# EAGLE design wa_amp (EAGLE 9.5.1)
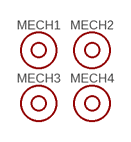
[diagram p0: schematic, sheet 1, part 1 of 2]
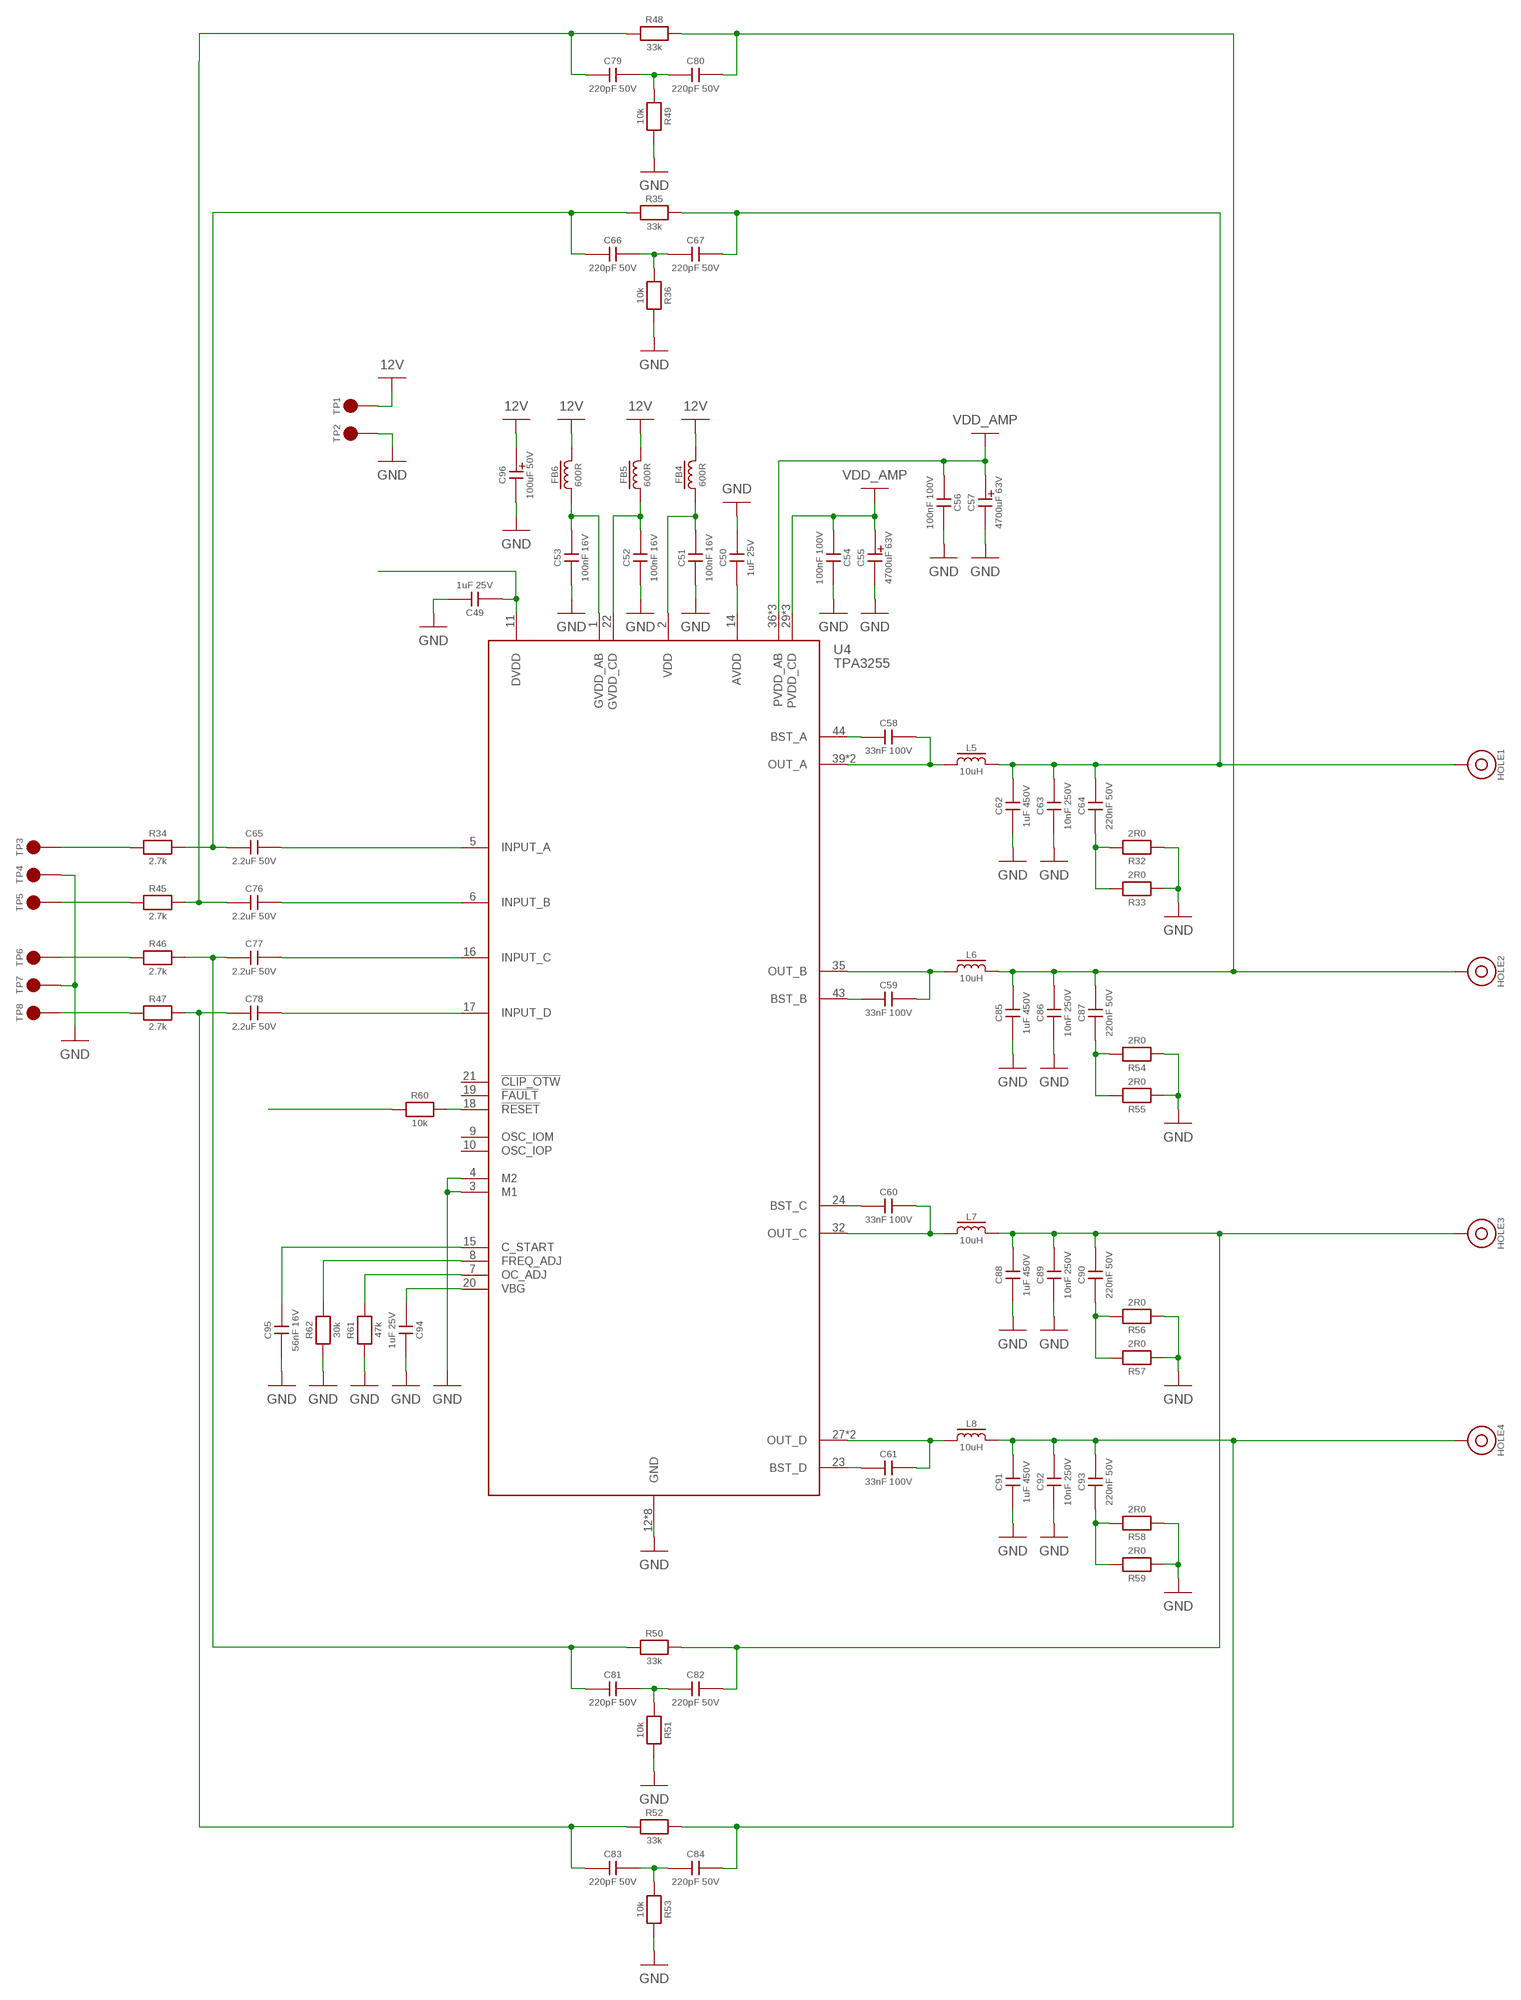
[diagram p1: schematic, sheet 1, part 2 of 2]

## Parts
C49  1uF 25V  CL10A105KA8NNNC  [0603]
C50  1uF 25V  CL10A105KA8NNNC  [0603]
C51  100nF 16V  CL10B104KO8WPNC  [0603]
C52  100nF 16V  CL10B104KO8WPNC  [0603]
C53  100nF 16V  CL10B104KO8WPNC  [0603]
C54  100nF 100V  06031C104KAT2A  [0603]
C55  4700uF 63V  B41231C8478M000  [30MM_RADIAL_10MM_PITCH]
C56  100nF 100V  06031C104KAT2A  [0603]
C57  4700uF 63V  B41231C8478M000  [30MM_RADIAL_10MM_PITCH]
C58  33nF 100V  C0603C333K1RACTU  [0603]
C59  33nF 100V  C0603C333K1RACTU  [0603]
C60  33nF 100V  C0603C333K1RACTU  [0603]
C61  33nF 100V  C0603C333K1RACTU  [0603]
C62  1uF 450V  ECWFE2W105K  [7X17.5BOX]
C63  10nF 250V  885342206006  [0603]
C64  220nF 50V  C1608X7R1H224K080AB  [0603]
C65  2.2uF 50V  MKS2B042201F00KSSD  [5X7.2BOX]
C66  220pF 50V  CC0603JRNPO9BN221  [0603]
C67  220pF 50V  CC0603JRNPO9BN221  [0603]
C76  2.2uF 50V  MKS2B042201F00KSSD  [5X7.2BOX]
C77  2.2uF 50V  MKS2B042201F00KSSD  [5X7.2BOX]
C78  2.2uF 50V  MKS2B042201F00KSSD  [5X7.2BOX]
C79  220pF 50V  CC0603JRNPO9BN221  [0603]
C80  220pF 50V  CC0603JRNPO9BN221  [0603]
C81  220pF 50V  CC0603JRNPO9BN221  [0603]
C82  220pF 50V  CC0603JRNPO9BN221  [0603]
C83  220pF 50V  CC0603JRNPO9BN221  [0603]
C84  220pF 50V  CC0603JRNPO9BN221  [0603]
C85  1uF 450V  ECWFE2W105K  [7X17.5BOX]
C86  10nF 250V  885342206006  [0603]
C87  220nF 50V  C1608X7R1H224K080AB  [0603]
C88  1uF 450V  ECWFE2W105K  [7X17.5BOX]
C89  10nF 250V  885342206006  [0603]
C90  220nF 50V  C1608X7R1H224K080AB  [0603]
C91  1uF 450V  ECWFE2W105K  [7X17.5BOX]
C92  10nF 250V  885342206006  [0603]
C93  220nF 50V  C1608X7R1H224K080AB  [0603]
C94  1uF 25V  CL10A105KA8NNNC  [0603]
C95  56nF 16V  GRM188R71C563JA01D  [0603]
C96  100uF 50V  107CKR050M  [8MM_RADIAL_3.5MM_PITCH]
FB4  600R  742792651  [0603]
FB5  600R  742792651  [0603]
FB6  600R  742792651  [0603]
HOLE1  MOUNTHOLE_METAL6X3  [MOUNTHOLE_6X3_METAL]
HOLE2  MOUNTHOLE_METAL6X3  [MOUNTHOLE_6X3_METAL]
HOLE3  MOUNTHOLE_METAL6X3  [MOUNTHOLE_6X3_METAL]
HOLE4  MOUNTHOLE_METAL6X3  [MOUNTHOLE_6X3_METAL]
L5  10uH  SRP1265A-100M  [SRP1265A]
L6  10uH  SRP1265A-100M  [SRP1265A]
L7  10uH  SRP1265A-100M  [SRP1265A]
L8  10uH  SRP1265A-100M  [SRP1265A]
MECH1  6mm x 3mm  MOUNTHOLE  [MOUNTHOLE_6X3]
MECH2  6mm x 3mm  MOUNTHOLE  [MOUNTHOLE_6X3]
MECH3  6mm x 3mm  MOUNTHOLE  [MOUNTHOLE_6X3]
MECH4  6mm x 3mm  MOUNTHOLE  [MOUNTHOLE_6X3]
R32  2R0  CRCW12062R00FNEA  [1206]
R33  2R0  CRCW12062R00FNEA  [1206]
R34  2.7k  ERJ3EKF2701V  [0603]
R35  33k  ERJ3EKF3302V  [0603]
R36  10k  ERJ3EKF1002V  [0603]
R45  2.7k  ERJ3EKF2701V  [0603]
R46  2.7k  ERJ3EKF2701V  [0603]
R47  2.7k  ERJ3EKF2701V  [0603]
R48  33k  ERJ3EKF3302V  [0603]
R49  10k  ERJ3EKF1002V  [0603]
R50  33k  ERJ3EKF3302V  [0603]
R51  10k  ERJ3EKF1002V  [0603]
R52  33k  ERJ3EKF3302V  [0603]
R53  10k  ERJ3EKF1002V  [0603]
R54  2R0  CRCW12062R00FNEA  [1206]
R55  2R0  CRCW12062R00FNEA  [1206]
R56  2R0  CRCW12062R00FNEA  [1206]
R57  2R0  CRCW12062R00FNEA  [1206]
R58  2R0  CRCW12062R00FNEA  [1206]
R59  2R0  CRCW12062R00FNEA  [1206]
R60  10k  ERJ3EKF1002V  [0603]
R61  47k  ERJ3EKF4702V  [0603]
R62  30k  ERJ3EKF3002V  [0603]
TP1  2MM_TEST_POINT  [2MM_TEST_PAD]
TP2  2MM_TEST_POINT  [2MM_TEST_PAD]
TP3  2MM_TEST_POINT  [2MM_TEST_PAD]
TP4  2MM_TEST_POINT  [2MM_TEST_PAD]
TP5  2MM_TEST_POINT  [2MM_TEST_PAD]
TP6  2MM_TEST_POINT  [2MM_TEST_PAD]
TP7  2MM_TEST_POINT  [2MM_TEST_PAD]
TP8  2MM_TEST_POINT  [2MM_TEST_PAD]
U4  TPA3255  [HTSSOP44]

## Nets
12V: C96.P(A) FB4.2 FB5.2 FB6.2 TP1.1
GND: C49.2 C50.2 C51.1 C52.1 C53.1 C54.2 C55.1(K) C56.2 C57.1(K) C62.1 C63.1 C85.1 C86.1 C88.1 C89.1 C91.1 C92.1 C94.2 C95.1 C96.N(K) R32.1 R33.1 R36.2 R49.2 R51.2 R53.2 R54.1 R55.1 R56.1 R57.1 R58.1 R59.1 R61.1 R62.1 TP2.1 TP4.1 TP7.1 U4.3(M1) U4.4(M2) U4.12(GND) U4.13(GND) U4.25(GND) U4.26(GND) U4.33(GND) U4.34(GND) U4.41(GND) U4.42(GND)
N$1: C50.1 U4.14(AVDD)
N$2: C77.1 C81.1 R46.2 R50.1
N$3: R34.1 TP3.1
N$4: R45.1 TP5.1
N$5: R46.1 TP6.1
N$6: R47.1 TP8.1
N$25: C51.2 FB4.1 U4.2(VDD)
N$31: C52.2 FB5.1 U4.22(GVDD_CD)
N$51: C53.2 FB6.1 U4.1(GVDD_AB)
N$52: C61.1 U4.23(BST_D)
N$53: C61.2 L8.1 U4.27(OUT_D) U4.28(OUT_D)
N$54: C60.1 U4.24(BST_C)
N$55: C60.2 L7.1 U4.32(OUT_C)
N$56: C59.1 U4.43(BST_B)
N$57: C59.2 L6.1 U4.35(OUT_B)
N$58: C58.1 U4.44(BST_A)
N$59: C58.2 L5.1 U4.39(OUT_A) U4.40(OUT_A)
N$60: C64.1 R32.2 R33.2
N$61: C65.2 U4.5(INPUT_A)
N$62: C65.1 C66.1 R34.2 R35.1
N$63: C62.2 C63.2 C64.2 C67.2 HOLE1.P$1 L5.2 R35.2
N$64: C66.2 C67.1 R36.1
N$75: C76.2 U4.6(INPUT_B)
N$76: C77.2 U4.16(INPUT_C)
N$77: C78.2 U4.17(INPUT_D)
N$78: C76.1 C79.1 R45.2 R48.1
N$79: C80.2 C85.2 C86.2 C87.2 HOLE2.P$1 L6.2 R48.2
N$80: C79.2 C80.1 R49.1
N$81: C78.1 C83.1 R47.2 R52.1
N$82: C82.2 C88.2 C89.2 C90.2 HOLE3.P$1 L7.2 R50.2
N$83: C81.2 C82.1 R51.1
N$85: C84.2 C91.2 C92.2 C93.2 HOLE4.P$1 L8.2 R52.2
N$86: C83.2 C84.1 R53.1
N$87: C87.1 R54.2 R55.2
N$88: C90.1 R56.2 R57.2
N$89: C93.1 R58.2 R59.2
N$90: R60.2 U4.18(!RESET)
N$91: C94.1 U4.20(VBG)
N$92: R61.2 U4.7(OC_ADJ)
N$93: R62.2 U4.8(FREQ_ADJ)
N$94: C95.2 U4.15(C_START)
TPA_VDD_1: C49.1 R60.1 U4.11(DVDD)
VDD_AMP: C54.1 C55.2(A) C56.1 C57.2(A) U4.29(PVDD_CD) U4.30(PVDD_CD) U4.31(PVDD_CD) U4.36(PVDD_AB) U4.37(PVDD_AB) U4.38(PVDD_AB)
Unconnected: U4.9(OSC_IOM) U4.10(OSC_IOP) U4.19(!FAULT) U4.21(!CLIP_OTW)

## Library data of the parts
C49 C50 C94 = CAPACITORS:CL10A105KA8NNNC: 1uF 25V X5R 10% 0603 MLCC.; DIGIKEY: 1276-1102-1-ND; HEIGHT: 1; PRICE_PER: 0.08
C51-C53 = CAPACITORS:CL10B104KO8WPNC: 100nF 16V X7R 10% 0603 MLCC; DIGIKEY: 1276-6582-1-ND; HEIGHT: 1; PRICE_PER: 0.08
C54 C56 = CAPACITORS:06031C104KAT2A: 100nF 100V X7R 10% 0603 MLCC.; FARNELL: 2749806; PRICE_PER: 0.0716
C55 C57 = CAPACITORS:B41231C8478M000: 4700uF 63V Electrolytic 20% 10mm radial.; DIGIKEY: 495-6169-ND; HEIGHT: 37; PRICE_PER: 2.62
C58-C61 = CAPACITORS:C0603C333K1RACTU: 33nF 100V X7R 10% 0603 MLCC.; FARNELL: 1865549; HEIGHT: 1; PRICE_PER: 0.214
C62 C85 C88 C91 = CAPACITORS:ECWFE2W105K: 1uF 450V Film 10% box; DIGIKEY: P16846-ND; HEIGHT: 13; PRICE_PER: 0.49
C63 C86 C89 C92 = CAPACITORS:885342206006: 10nF 250V X7R 10% 0603 MLCC.; DIGIKEY: 732-12168-1-ND; HEIGHT: 1; PRICE_PER: 0.09
C64 C87 C90 C93 = CAPACITORS:C1608X7R1H224K080AB: 220nF 50V X7R 10% 0603 MLCC.; FARNELL: 2346906; HEIGHT: 1; PRICE_PER: 0.0536
C65 C76-C78 = CAPACITORS:MKS2B042201F00KSSD: 2.2uF 50V FILM 10% 7.2 x 5mm BOX; FARNELL: 107422; HEIGHT: 10; PRICE_PER: 1.28
C66 C67 C79-C84 = CAPACITORS:CC0603JRNPO9BN221: 220pF 50V C0G/NP0 5% 0603 MLCC; DIGIKEY: 311-1073-1-ND; HEIGHT: 1; PRICE_PER: 0.08
C95 = CAPACITORS:GRM188R71C563JA01D: 56nF 16V X7R 10% 0603 MLCC.; DIGIKEY: 490-12540-1-ND; HEIGHT: 0.9; PRICE_PER: 0.14
C96 = CAPACITORS:107CKR050M: 100uF 50V Electrolytic 20% 8mm radial.; DIGIKEY: 1572-1044-ND; HEIGHT: 14; PRICE_PER: 0.223
FB4-FB6 = INDUCTORS:742792651: Ferrite Bead 600R at 100MHz 0603.; FARNELL: 1635706
HOLE1-HOLE4 = MISC:MOUNTHOLE_METAL: Mount hole with connection.
L5-L8 = INDUCTORS:SRP1265A-100M: Power Inductor (SMD), 10 µH, 10 A, Shielded, 15.5 A, SRP1265A Series, 13.5mm x 12.5mm x 6.2mm; FARNELL: 2434072; HEIGHT: 6.2; PRICE_PER: 1.32
MECH1-MECH4 = MISC:MOUNTHOLE: Mechanical mounting hole.
R32 R33 R54-R59 = RESISTORS:CRCW12062R00FNEA: 2 2R0 1206 0.25W 1% thick film resistor; FARNELL: 1653107; HEIGHT: 0.65; PRICE_PER: 0.0375
R34 R45-R47 = r_0603:ERJ3EKF2701V: 2700 2.7k 0603 0.1W 1% thick film resistor.; DIGIKEY: P2.70KHCT-ND; PRICE_PER: 0.10000
R35 R48 R50 R52 = r_0603:ERJ3EKF3302V: 33000 33k 0603 0.1W 1% thick film resistor.; DIGIKEY: P33.0KHCT-ND; PRICE_PER: 0.10000
R36 R49 R51 R53 R60 = r_0603:ERJ3EKF1002V: 10000 10k 0603 0.1W 1% thick film resistor.; DIGIKEY: P10.0KHCT-ND; PRICE_PER: 0.10000
R61 = r_0603:ERJ3EKF4702V: 47000 47k 0603 0.1W 1% thick film resistor.; DIGIKEY: P47.0KHCT-ND; PRICE_PER: 0.10000
R62 = r_0603:ERJ3EKF3002V: 30000 30k 0603 0.1W 1% thick film resistor.; DIGIKEY: P30.0KHCT-ND; PRICE_PER: 0.10000
TP1-TP8 = MISC:2MM_TEST_POINT: A 2MM round pad for test purposes.
U4 = ICs:TPA3255: 315-W Stereo, 600-W Mono PurePath™ Ultra-HD Analog-Input; DIGIKEY: 296-45124-5-ND; HEIGHT: 1.2; PRICE_PER: 8.67

## Board
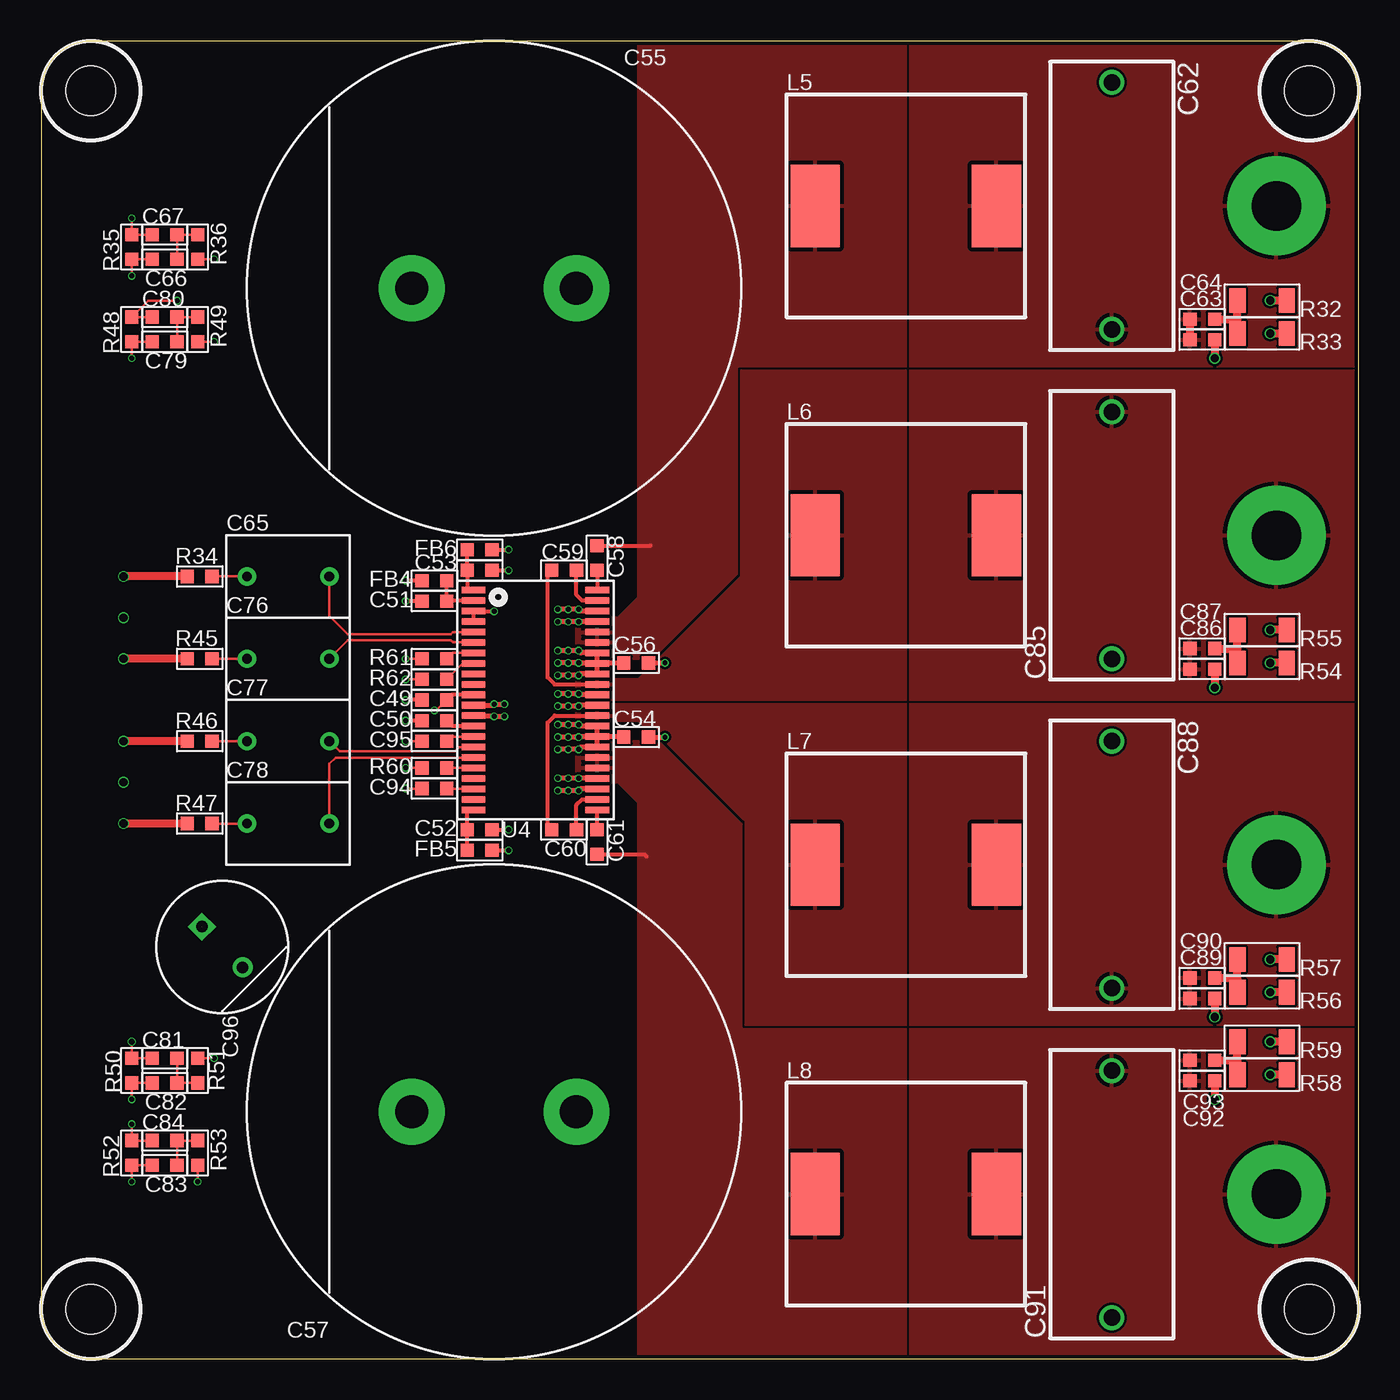
[diagram p2: board, top side]
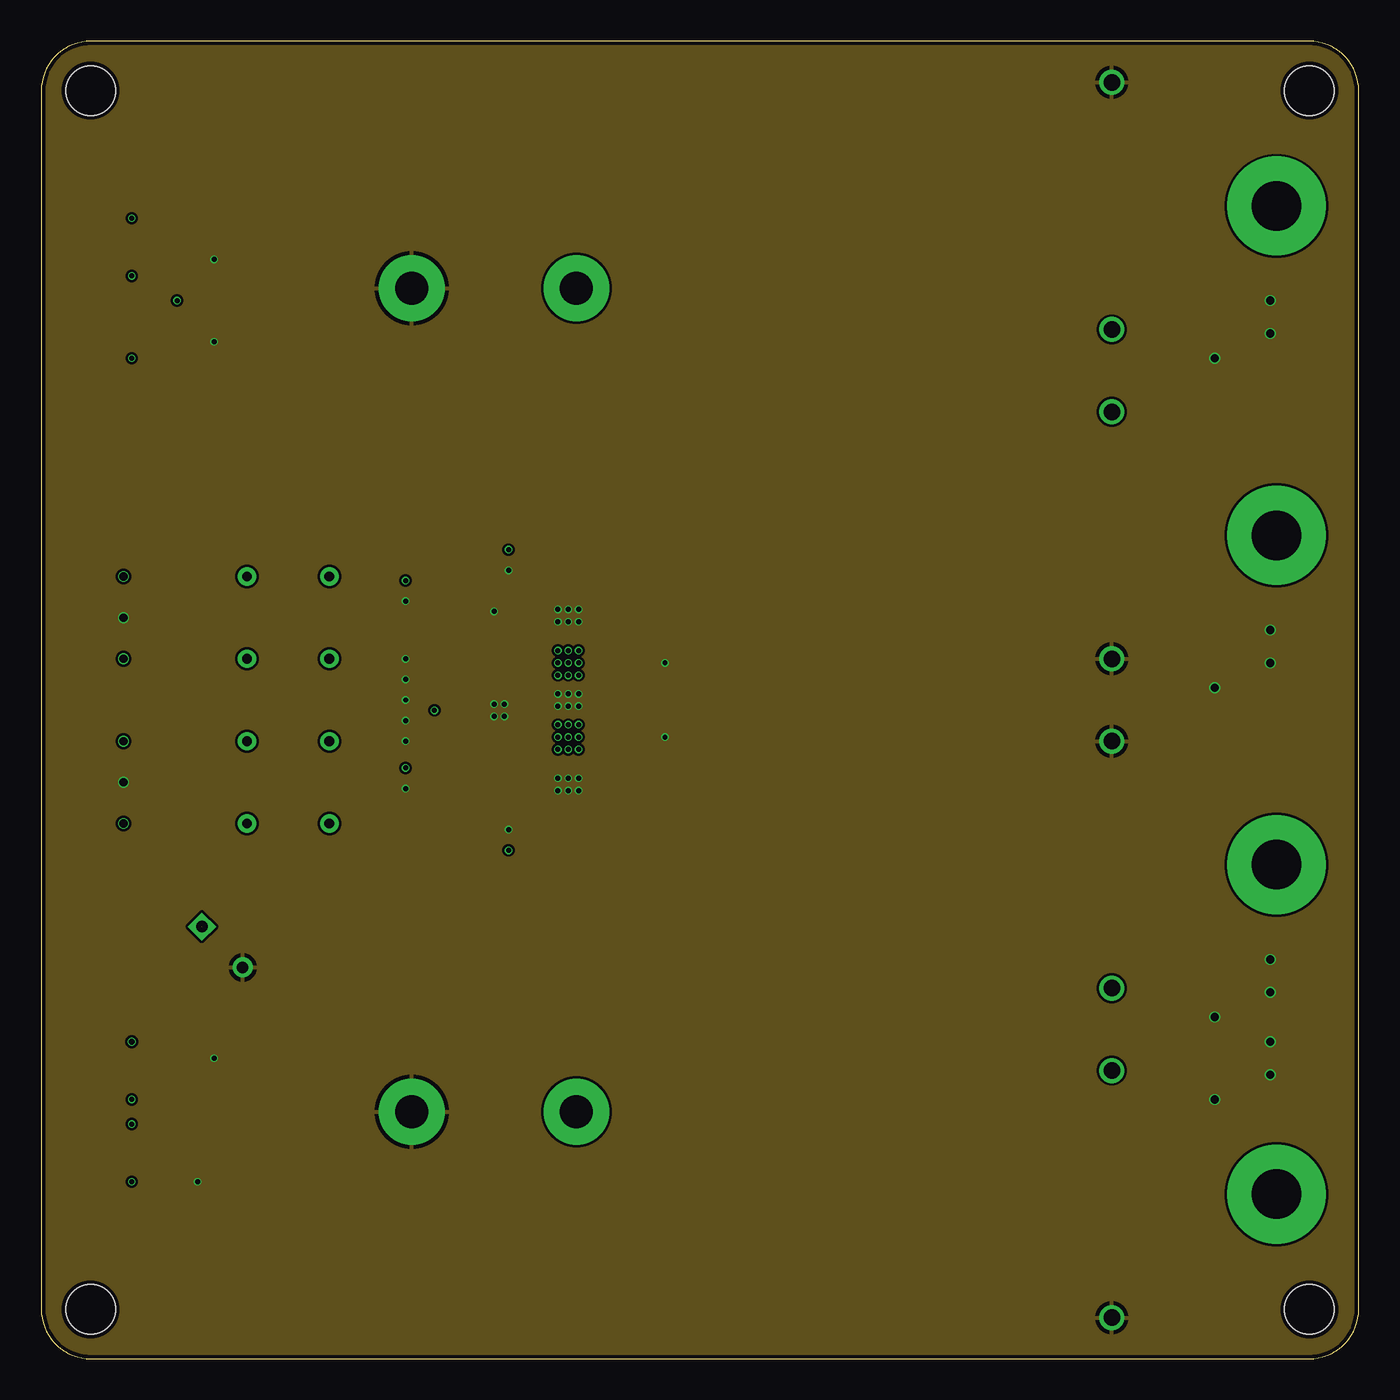
[diagram p3: board, inner layer GND]
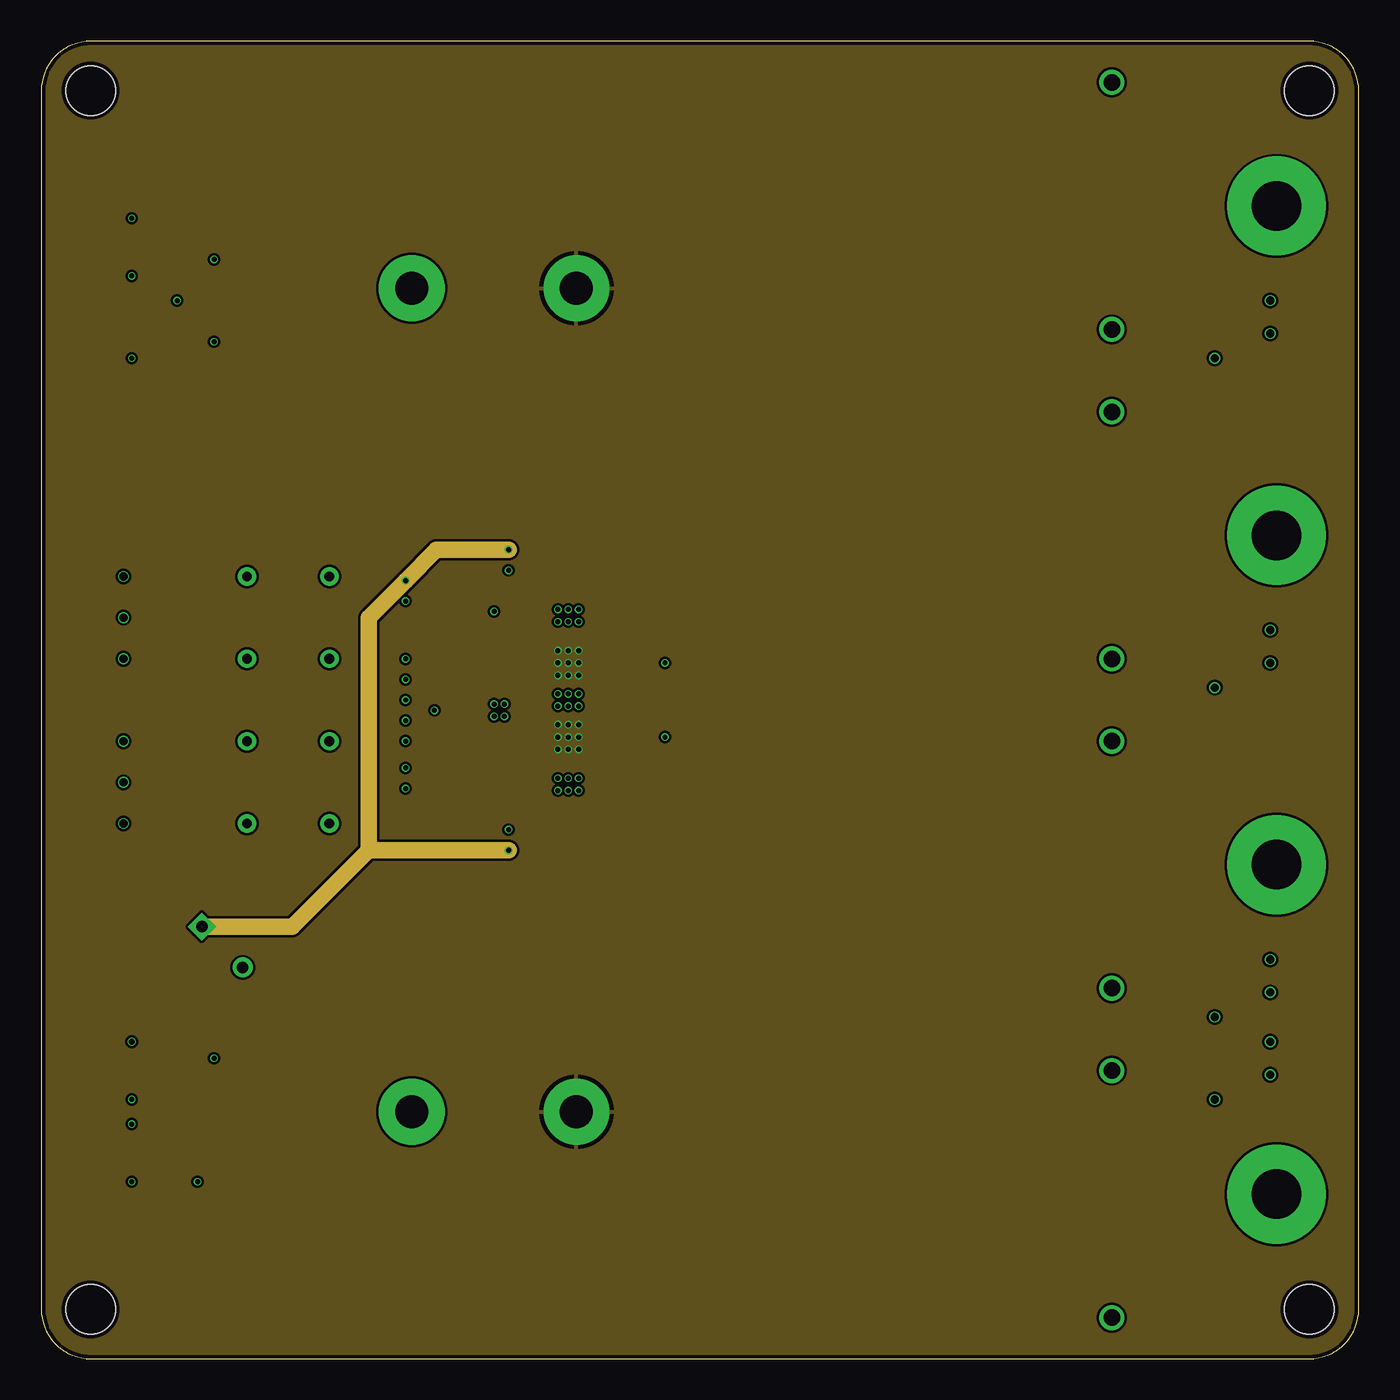
[diagram p4: board, inner layer PWR]
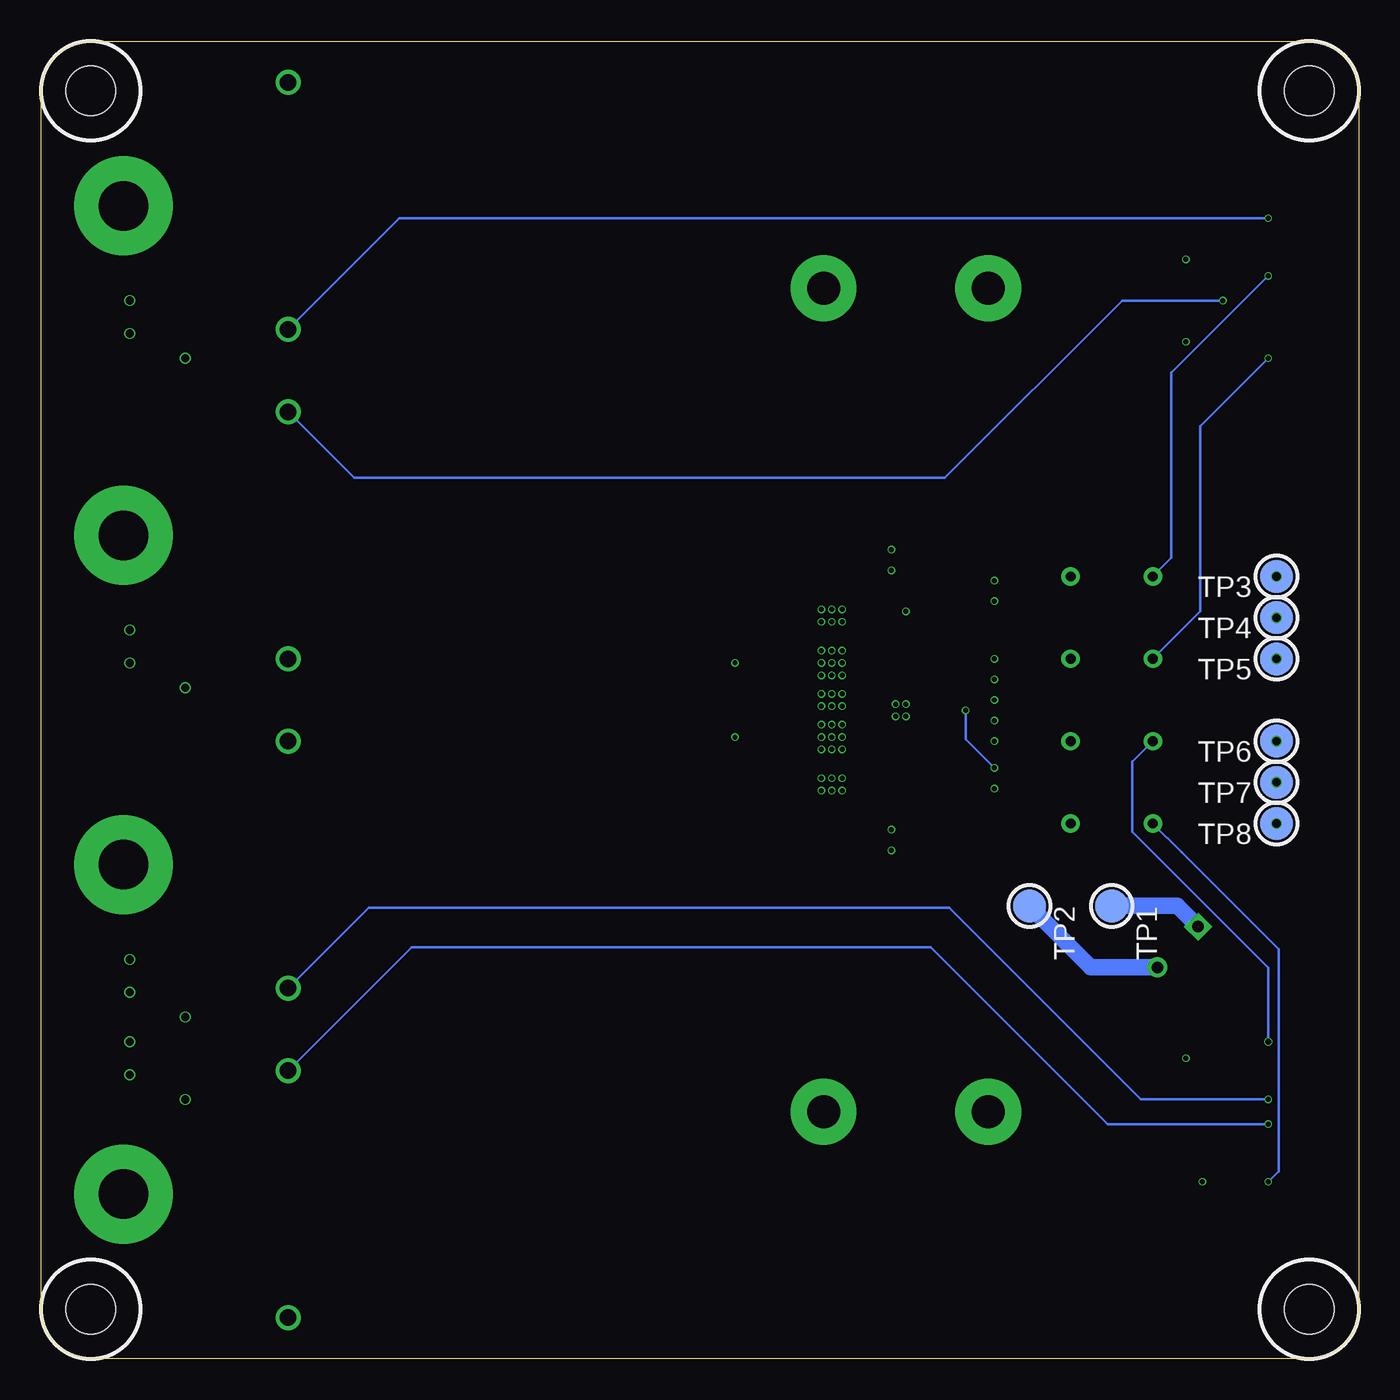
[diagram p5: board, bottom side, seen from below]

Size 80 x 80 mm. Coordinates in mm from the lower left corner, seen from the top.
Outline: 0,77 0,3 arc90 3,0 77,0 arc90 80,3 80,77 arc90 77,80 3,80 arc90 0,77
Copper layers (1*2*3*16): Top 0.035mm / dielectric 1.5mm / GND 0.035mm / dielectric 0.15mm / PWR 0.035mm / dielectric 0.2mm / Bottom 0.035mm
Design rules "myDRC 4 layers 0.25mm": minimum track width 0.15mm, minimum drill 0.25mm, track to track 0.15mm, track to pad 0.15mm, pad to pad 0.15mm, via to via 0.15mm, smd to smd 0mil, copper to edge 0.25mm, drill to drill 0.25mm, minimum pad ring 10mil, minimum via ring 3mil, stop-mask expansion 4mil, vias tented up to drill 0.3mm, thermal gap 10mil

### Footprints (pad centres in the part's own frame; a part is rotated, then mirrored left to right if it is on the bottom)
0603 = smd 0.8 x 0.8: 1 -0.75,0; 2 0.75,0
30MM_RADIAL_10MM_PITCH = drill 2 pad 4: 1 5,0; 2 -5,0
7X17.5BOX = drill 1: 1 -7.5,0; 2 7.5,0
5X7.2BOX = drill 0.6: 1 -2.5,0; 2 2.5,0
8MM_RADIAL_3.5MM_PITCH = drill 0.7: N 1.75,0 | drill 0.7 square: P -1.75,0
MOUNTHOLE_6X3_METAL = drill 3 pad 6: P$1 0,0
SRP1265A = smd 3 x 5: 1 -5.5,0; 2 5.5,0
MOUNTHOLE_6X3 = hole 3: 0,0
1206 = smd 1 x 1.5: 1 1.5,0; 2 -1.5,0
2MM_TEST_PAD = smd 2 x 2: 1 0,0
HTSSOP44 = smd 1.45 x 0.4: 1 -3.75,6.668; 2 -3.75,6.032; 3 -3.75,5.397; 4 -3.75,4.763; 5 -3.75,4.128; 6 -3.75,3.493; 7 -3.75,2.857; 8 -3.75,2.223; 9 -3.75,1.587; 10 -3.75,0.953; 11 -3.75,0.318; 12 -3.75,-0.318; 13 -3.75,-0.953; 14 -3.75,-1.587; 15 -3.75,-2.223; 16 -3.75,-2.857; 17 -3.75,-3.493; 18 -3.75,-4.128; 19 -3.75,-4.763; 20 -3.75,-5.397; 21 -3.75,-6.032; 22 -3.75,-6.668; 23 3.75,-6.668; 24 3.75,-6.032; 25 3.75,-5.397; 26 3.75,-4.763; 27 3.75,-4.128; 28 3.75,-3.493; 29 3.75,-2.857; 30 3.75,-2.223; 31 3.75,-1.587; 32 3.75,-0.953; 33 3.75,-0.318; 34 3.75,0.318; 35 3.75,0.953; 36 3.75,1.587; 37 3.75,2.223; 38 3.75,2.857; 39 3.75,3.493; 40 3.75,4.128; 41 3.75,4.763; 42 3.75,5.397; 43 3.75,6.032; 44 3.75,6.668

### Placement (x,y rotation side)
C49  23.88,40 180 top
C50  23.88,38.75 180 top
C51  23.88,46 0 top
C52  26.62,32.12 180 top
C53  26.62,47.88 180 top
C54  36.12,37.75 0 top
C55  27.5,65 180 top
C56  36.12,42.25 0 top
C57  27.5,15 180 top
C58  33.75,48.62 90 top
C59  31.75,47.88 180 top
C60  31.75,32.12 180 top
C61  33.75,31.38 270 top
C62  65,70 270 top
C63  70.5,61.88 180 top
C64  70.5,63.12 180 top
C65  15,47.5 0 top
C66  7.5,66.75 0 top
C67  7.5,68.25 180 top
C76  15,42.5 0 top
C77  15,37.5 0 top
C78  15,32.5 0 top
C79  7.5,61.75 0 top
C80  7.5,63.25 180 top
C81  7.5,18.25 0 top
C82  7.5,16.75 180 top
C83  7.5,11.75 0 top
C84  7.5,13.25 180 top
C85  65,50 90 top
C86  70.5,41.88 180 top
C87  70.5,43.12 180 top
C88  65,30 270 top
C89  70.5,21.88 180 top
C90  70.5,23.12 180 top
C91  65,10 90 top
C92  70.5,16.88 180 top
C93  70.5,18.12 180 top
C94  23.88,34.62 180 top
C95  23.88,37.5 0 top
C96  11,25 315 top
FB4  23.88,47.25 180 top
FB5  26.62,30.88 0 top
FB6  26.62,49.12 0 top
HOLE1  75,70 0 top
HOLE2  75,50 0 top
HOLE3  75,30 0 top
HOLE4  75,10 0 top
L5  52.5,70 0 top
L6  52.5,50 0 top
L7  52.5,30 0 top
L8  52.5,10 0 top
MECH1  3,3 0 top
MECH2  3,77 0 top
MECH3  77,3 0 top
MECH4  77,77 0 top
R32  74.12,64.25 0 top
R33  74.12,62.25 0 top
R34  9.62,47.5 0 top
R35  5.5,67.5 90 top
R36  9.5,67.5 270 top
R45  9.62,42.5 0 top
R46  9.62,37.5 0 top
R47  9.62,32.5 0 top
R48  5.5,62.5 90 top
R49  9.5,62.5 270 top
R50  5.5,17.5 270 top
R51  9.5,17.5 90 top
R52  5.5,12.5 90 top
R53  9.5,12.5 270 top
R54  74.12,42.25 0 top
R55  74.12,44.25 0 top
R56  74.12,22.25 0 top
R57  74.12,24.25 0 top
R58  74.12,17.25 0 top
R59  74.12,19.25 0 top
R60  23.88,35.88 0 top
R61  23.88,42.5 0 top
R62  23.88,41.25 0 top
TP1  15,27.5 270 bottom
TP2  20,27.5 270 bottom
TP3  5,47.5 0 bottom
TP4  5,45 0 bottom
TP5  5,42.5 0 bottom
TP6  5,37.5 0 bottom
TP7  5,35 0 bottom
TP8  5,32.5 0 bottom
U4  30,40 0 top

### Tracks (layer width: path | path; a pad name or v marks a point on that pad's centre or on a via)
12V  (via drill 0.3)  (1 unrouted)
  Top 0.25: FB5.2 v28.38,30.88 | FB4.2 v22.12,47.25 | FB6.2 v28.38,49.12
  PWR 1: C96.P 15.24,26.24 19.88,30.88 | 19.88,30.88 19.88,45 v22.12,47.25 24,49.12 v28.38,49.12 | 19.88,30.88 v28.38,30.88
  Bottom 1: TP1.1 11.02,27.5 C96.P
GND  (via drill 0.3, 0.5)
  Top 0.15: R49.2 v10.5,61.75 | R36.2 v10.5,66.75 | R51.2 v10.5,18.25 | R53.2 v9.5,10.75 | R62.1 v22.12,41.25 | R61.1 v22.12,42.5 | C95.1 v22.12,37.5 | C94.2 v22.12,34.62
  Top 0.25: C49.2 v22.12,40 | C50.2 v22.12,38.75 | C52.1 v28.38,32.12 | C51.1 v22.12,46 | C53.1 v28.38,47.88 | v27.5,45.38 27.48,45.4 U4.3 U4.4
  Top 0.3: U4.33 32.68,39.68 v32.62,39.62 v32,39.62 v31.38,39.62 | U4.34 32.68,40.32 v32.62,40.38 v32,40.38 v31.38,40.38 | U4.41 32.64,44.76 v32.62,44.75 v32,44.75 v31.38,44.75 | U4.42 32.73,45.4 v32.62,45.5 v32,45.5 v31.38,45.5 | U4.26 33.74,35.25 v32.62,35.25 v32,35.25 v31.38,35.25 | U4.25 32.73,34.6 v32.62,34.5 v32,34.5 v31.38,34.5 | U4.12 27.43,39.68 v27.5,39.75 v28.12,39.75 | U4.13 27.45,39.05 v27.5,39 v28.12,39 | C56.2 v37.88,42.25 | C54.2 v37.88,37.75
  Top 0.5: C63.1 v71.25,60.75 | R33.1 v74.62,62.25 | R32.1 v74.62,64.25 | R55.1 v74.62,44.25 | R54.1 v74.62,42.25 | C86.1 v71.25,40.75 | R57.1 v74.62,24.25 | R56.1 v74.62,22.25 | C89.1 v71.25,20.75 | C92.1 v71.25,15.75 | R58.1 v74.62,17.25 | R59.1 v74.62,19.25
  Bottom 1: TP2.1 16.26,23.76 C96.N
  other vias: 5,45 5,35
  pour GND (isolate 0.15): -20,90 80,90 80,-10 -20,-10
N$1
  Top 0.25: U4.14 24.96,38.41 C50.1
N$2  (via drill 0.35)
  Top 0.15: C81.1 R50.1 | R46.2 C77.1
  Top 0.152: R50.1 v5.5,19.25
  Bottom 0.152: C77.1 13.75,36.25 13.75,32 5.5,23.75 v5.5,19.25
N$3  (via drill 0.5)
  Top 0.5: R34.1 TP3.1
  other vias: 5,47.5
N$4  (via drill 0.5)
  Top 0.5: R45.1 TP5.1
  other vias: 5,42.5
N$5  (via drill 0.5)
  Top 0.5: R46.1 TP6.1
  other vias: 5,37.5
N$6  (via drill 0.5)
  Top 0.5: R47.1 TP8.1
  other vias: 5,32.5
N$25
  Top 0.25: U4.2 24.66,46.03 C51.2 FB4.1
N$31
  Top 0.25: FB5.1 C52.2 25.88,33.21 26,33.33 U4.22
N$51
  Top 0.25: 26,46.67 25.88,46.79 C53.2 FB6.1
  Top 0.3: 26,46.67 U4.1
N$52
  Top 0.25: C61.1 U4.23
N$53
  Top 0.25: C61.2 36.62,30.62 36.75,30.5
  pour Top (isolate 0.15, rank 3): 32.5,35 35,35 36.25,33.75 36.25,0 52.5,0 52.5,20 42.5,20 42.5,32.5 37.5,37.5 32.5,37.5
N$54
  Top 0.25: C60.1 32.5,33.62 32.84,33.97 U4.24
N$55
  Top 0.25: C60.2 30.75,32.38 30.75,38.62 31.17,39.05 U4.32
  pour Top (isolate 0.15, rank 4): 32.5,40 52.5,40 52.5,20 42.5,20 42.5,32.5 36.25,38.75 32.5,38.75
N$56
  Top 0.25: U4.43 32.84,46.03 32.5,46.38 C59.1
N$57
  Top 0.25: U4.35 31.17,40.95 30.75,41.38 30.75,47.62 C59.2
  pour Top (isolate 0.15, rank 3): 32.5,41.25 36.25,41.25 42.5,47.5 42.5,60 52.5,60 52.5,40 32.5,40
N$58
  Top 0.25: C58.1 U4.44
N$59
  Top 0.25: C58.2 37,49.38
  pour Top (isolate 0.15, rank 4): 32.5,42.5 37.5,42.5 42.5,47.5 42.5,60 52.5,60 52.5,80 36.25,80 36.25,46.25 35,45 32.5,45
N$60
  Top 0.5: C64.1 72.62,63.12 | 72.62,63.12 R32.2 | R33.2 72.62,63.12
N$61
  Top 0.15: U4.5 25,44.13 24.88,44 18.62,44 17.5,45.12 C65.2
N$62  (via drill 0.3)
  Top 0.15: R34.2 C65.1 | C66.1 R35.1 v5.5,65.75
  Bottom 0.15: v5.5,65.75 11.38,59.88 11.38,48.62 C65.1
N$63  (via drill 0.3)
  Top 0.15: C67.2 R35.2 v5.5,69.25
  Top 0.5: C64.2 C63.2
  Bottom 0.15: C62.2 58.25,69.25 v5.5,69.25
  pour Top (rank 6): 52.5,80 52.5,60 80,60 80,80
N$64
  Top 0.15: R36.1 C67.1 C66.2
N$75
  Top 0.15: U4.6 25.01,43.49 24.88,43.62 18.62,43.62 C76.2
N$76
  Top 0.15: U4.16 25.39,37.14 25.12,36.88 18.12,36.88 C77.2
N$77
  Top 0.15: U4.17 17.88,36.51 17.5,36.12 C78.2
N$78  (via drill 0.3)
  Top 0.15: R45.2 C76.1 | C79.1 R48.1 v5.5,60.75
  Bottom 0.15: v5.5,60.75 9.62,56.62 9.62,45.38 C76.1
N$79  (via drill 0.3)
  Top 0.15: C80.2 R48.2 6.5,64.25 v8.25,64.25
  Bottom 0.15: v8.25,64.25 14.38,64.25 25.12,53.5 61,53.5 C85.2
  pour Top (rank 5): 52.5,60 52.5,40 80,40 80,60
N$80
  Top 0.15: C79.2 C80.1 R49.1
N$81  (via drill 0.3)
  Top 0.15: R47.2 C78.1 | v5.5,10.75 R52.1 C83.1
  Bottom 0.15: v5.5,10.75 4.88,11.38 4.88,24.88 10.75,30.75
  Bottom 0.152: 10.75,30.75 C78.1
N$82  (via drill 0.3)
  Top 0.15: C82.2 R50.2 v5.5,15.75
  Bottom 0.15: v5.5,15.75 13.25,15.75 24.88,27.38 60.12,27.38 C88.2
  pour Top (rank 6): 52.5,40 52.5,20 80,20 80,40
N$83
  Top 0.15: R51.1 C82.1 C81.2
N$85  (via drill 0.3)
  Top 0.15: v5.5,14.25 R52.2 C84.2
  Bottom 0.15: v5.5,14.25 15.25,14.25 26,25 57.5,25 C91.2
  pour Top (rank 5): 52.5,20 52.5,0 80,0 80,20
N$86
  Top 0.15: C83.2 C84.1 R53.1
N$87
  Top 0.5: C87.1 72.62,43.12 | 72.62,43.12 R55.2 | R54.2 72.62,43.12
N$88
  Top 0.5: C90.1 72.62,23.12 | 72.62,23.12 R57.2 | R56.2 72.62,23.12
N$89
  Top 0.5: R58.2 72.62,18.12 | 72.62,18.12 R59.2 | C93.1 72.62,18.12
N$90
  Top 0.15: U4.18 R60.2
N$91
  Top 0.15: U4.20 24.65,34.6 C94.1
N$92
  Top 0.15: U4.7 24.98,42.86 R61.2
N$93
  Top 0.15: U4.8 25.6,42.22 R62.2
N$94
  Top 0.15: U4.15 24.9,37.78 C95.2
TPA_VDD_1  (via drill 0.3)
  Top 0.15: R60.1 v22.12,35.88 | C49.1 24,39.38 v23.88,39.38
  Top 0.25: U4.11 24.94,40.32 C49.1
  Bottom 0.15: v22.12,35.88 23.88,37.62 v23.88,39.38
VDD_AMP  (via drill 0.3)
  Top 0.3: C56.1 35.35,42.22 U4.37 | C54.1 35.35,37.78 U4.30 | U4.30 32.65,37.78 v32.62,37.75 v32,37.75 v31.38,37.75 | U4.37 32.65,42.22 v32.62,42.25 v32,42.25 v31.38,42.25 | U4.30 U4.29 32.77,37.14 v32.62,37 v32,37 v31.38,37 | U4.30 U4.31 32.71,38.41 v32.62,38.5 v32,38.5 v31.38,38.5 | U4.37 U4.36 32.71,41.59 v32.62,41.5 v32,41.5 v31.38,41.5 | U4.37 U4.38 32.77,42.86 v32.62,43 v32,43 v31.38,43
  pour PWR (isolate 0.15): -20,90 80,90 80,-10 -20,-10